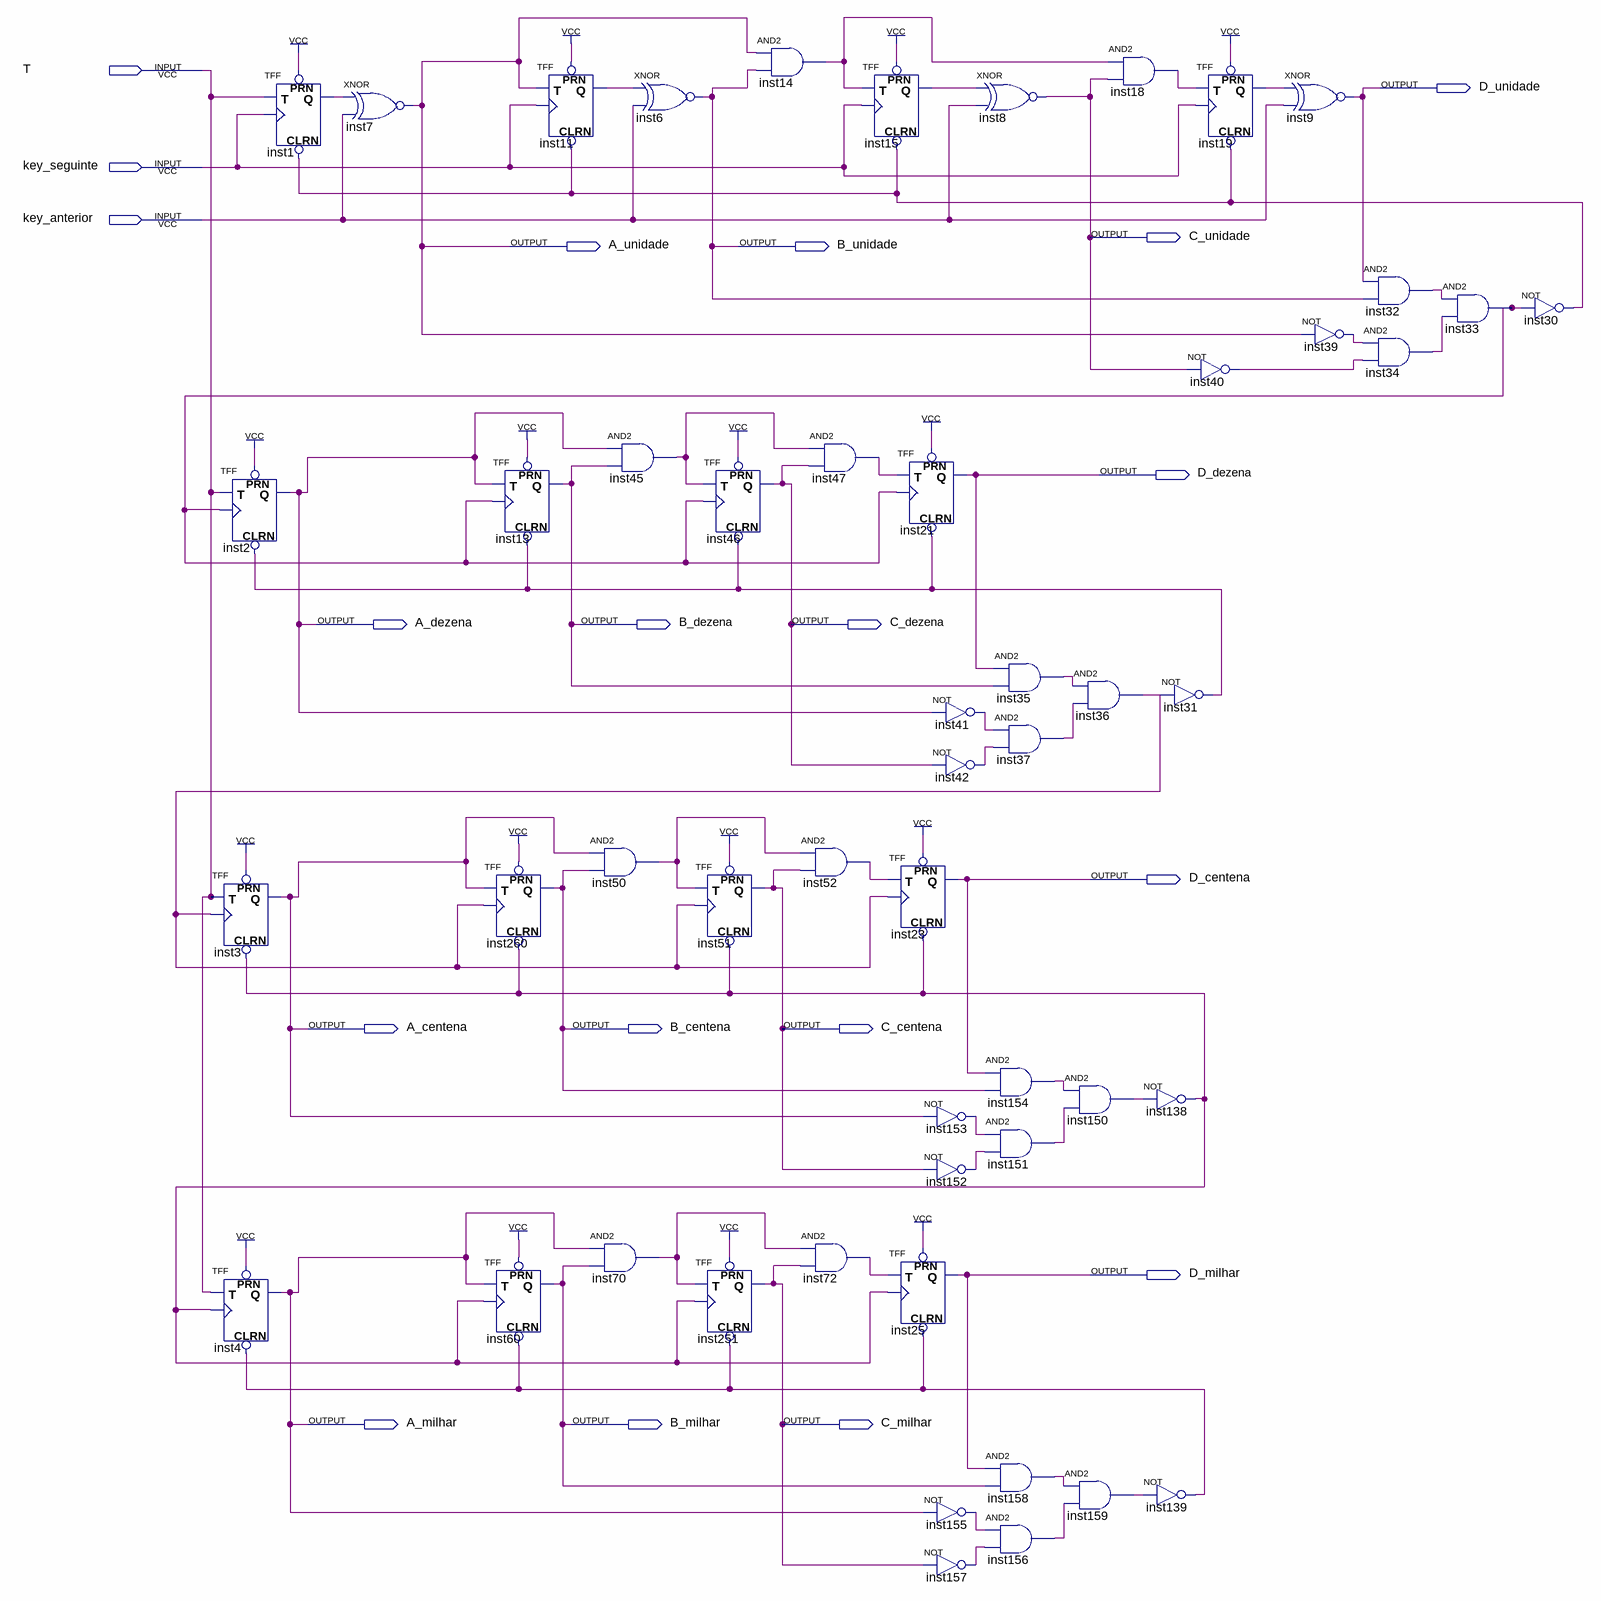
[diagram p0: schematic sheet]
// Quartus schematic Contador_botaodf.bdf as structural Verilog: 52 symbols, 19 pins
module Contador_botaodf (
  input  T,
  input  key_seguinte,
  input  key_anterior,
  output D_unidade,
  output C_unidade,
  output A_unidade,
  output B_unidade,
  output D_dezena,
  output A_dezena,
  output B_dezena,
  output C_dezena,
  output D_centena,
  output A_centena,
  output B_centena,
  output C_centena,
  output D_milhar,
  output A_milhar,
  output B_milhar,
  output C_milhar
);

  wire inst1_q, inst11_q, inst14_out, inst15_q, inst18_out, inst19_q, inst30_out, inst31_out, inst32_out,
       inst33_out, inst34_out, inst35_out, inst36_out, inst37_out, inst39_out, inst40_out, inst41_out,
       inst42_out, inst45_out, inst47_out, inst50_out, inst52_out, inst70_out, inst72_out, inst138_out,
       inst139_out, inst150_out, inst151_out, inst152_out, inst153_out, inst154_out, inst155_out,
       inst156_out, inst157_out, inst158_out, inst159_out;

  TFF inst2 (.PRN(1'b1), .CLRN(inst31_out), .T(T), .CLK(inst33_out), .Q(A_dezena));
  TFF inst3 (.PRN(1'b1), .CLRN(inst138_out), .T(T), .CLK(inst36_out), .Q(A_centena));
  TFF inst4 (.PRN(1'b1), .CLRN(inst139_out), .T(T), .CLK(inst138_out), .Q(A_milhar));
  TFF inst1 (.PRN(1'b1), .CLRN(inst30_out), .T(T), .CLK(key_seguinte), .Q(inst1_q));
  xnor inst7 (A_unidade, inst1_q, key_anterior);
  TFF inst13 (.PRN(1'b1), .CLRN(inst31_out), .T(A_dezena), .CLK(inst33_out), .Q(B_dezena));
  TFF inst260 (.PRN(1'b1), .CLRN(inst138_out), .T(A_centena), .CLK(inst36_out), .Q(B_centena));
  TFF inst60 (.PRN(1'b1), .CLRN(inst139_out), .T(A_milhar), .CLK(inst138_out), .Q(B_milhar));
  TFF inst11 (.PRN(1'b1), .CLRN(inst30_out), .T(A_unidade), .CLK(key_seguinte), .Q(inst11_q));
  and inst50 (inst50_out, A_centena, B_centena);
  and inst70 (inst70_out, A_milhar, B_milhar);
  xnor inst6 (B_unidade, inst11_q, key_anterior);
  and inst45 (inst45_out, A_dezena, B_dezena);
  TFF inst46 (.PRN(1'b1), .CLRN(inst31_out), .T(inst45_out), .CLK(inst33_out), .Q(C_dezena));
  TFF inst51 (.PRN(1'b1), .CLRN(inst138_out), .T(inst50_out), .CLK(inst36_out), .Q(C_centena));
  TFF inst251 (.PRN(1'b1), .CLRN(inst139_out), .T(inst70_out), .CLK(inst138_out), .Q(C_milhar));
  and inst14 (inst14_out, A_unidade, B_unidade);
  and inst52 (inst52_out, inst50_out, C_centena);
  and inst72 (inst72_out, inst70_out, C_milhar);
  TFF inst15 (.PRN(1'b1), .CLRN(inst30_out), .T(inst14_out), .CLK(key_seguinte), .Q(inst15_q));
  and inst47 (inst47_out, inst45_out, C_dezena);
  TFF inst21 (.PRN(1'b1), .CLRN(inst31_out), .T(inst47_out), .CLK(inst33_out), .Q(D_dezena));
  not inst41 (inst41_out, A_dezena);
  not inst42 (inst42_out, C_dezena);
  TFF inst23 (.PRN(1'b1), .CLRN(inst138_out), .T(inst52_out), .CLK(inst36_out), .Q(D_centena));
  not inst153 (inst153_out, A_centena);
  not inst152 (inst152_out, C_centena);
  TFF inst25 (.PRN(1'b1), .CLRN(inst139_out), .T(inst72_out), .CLK(inst138_out), .Q(D_milhar));
  not inst155 (inst155_out, A_milhar);
  not inst157 (inst157_out, C_milhar);
  xnor inst8 (C_unidade, inst15_q, key_anterior);
  and inst35 (inst35_out, D_dezena, B_dezena);
  and inst37 (inst37_out, inst41_out, inst42_out);
  and inst154 (inst154_out, D_centena, B_centena);
  and inst151 (inst151_out, inst153_out, inst152_out);
  and inst158 (inst158_out, D_milhar, B_milhar);
  and inst156 (inst156_out, inst155_out, inst157_out);
  and inst36 (inst36_out, inst35_out, inst37_out);
  and inst150 (inst150_out, inst154_out, inst151_out);
  and inst159 (inst159_out, inst158_out, inst156_out);
  and inst18 (inst18_out, inst14_out, C_unidade);
  not inst138 (inst138_out, inst150_out);
  not inst139 (inst139_out, inst159_out);
  TFF inst19 (.PRN(1'b1), .CLRN(inst30_out), .T(inst18_out), .CLK(key_seguinte), .Q(inst19_q));
  not inst40 (inst40_out, C_unidade);
  not inst31 (inst31_out, inst36_out);
  xnor inst9 (D_unidade, inst19_q, key_anterior);
  and inst32 (inst32_out, D_unidade, B_unidade);
  not inst39 (inst39_out, A_unidade);
  and inst34 (inst34_out, inst39_out, inst40_out);
  and inst33 (inst33_out, inst32_out, inst34_out);
  not inst30 (inst30_out, inst33_out);
endmodule
